# Altium project PICO_Probe_v_2_1.PrjPcb
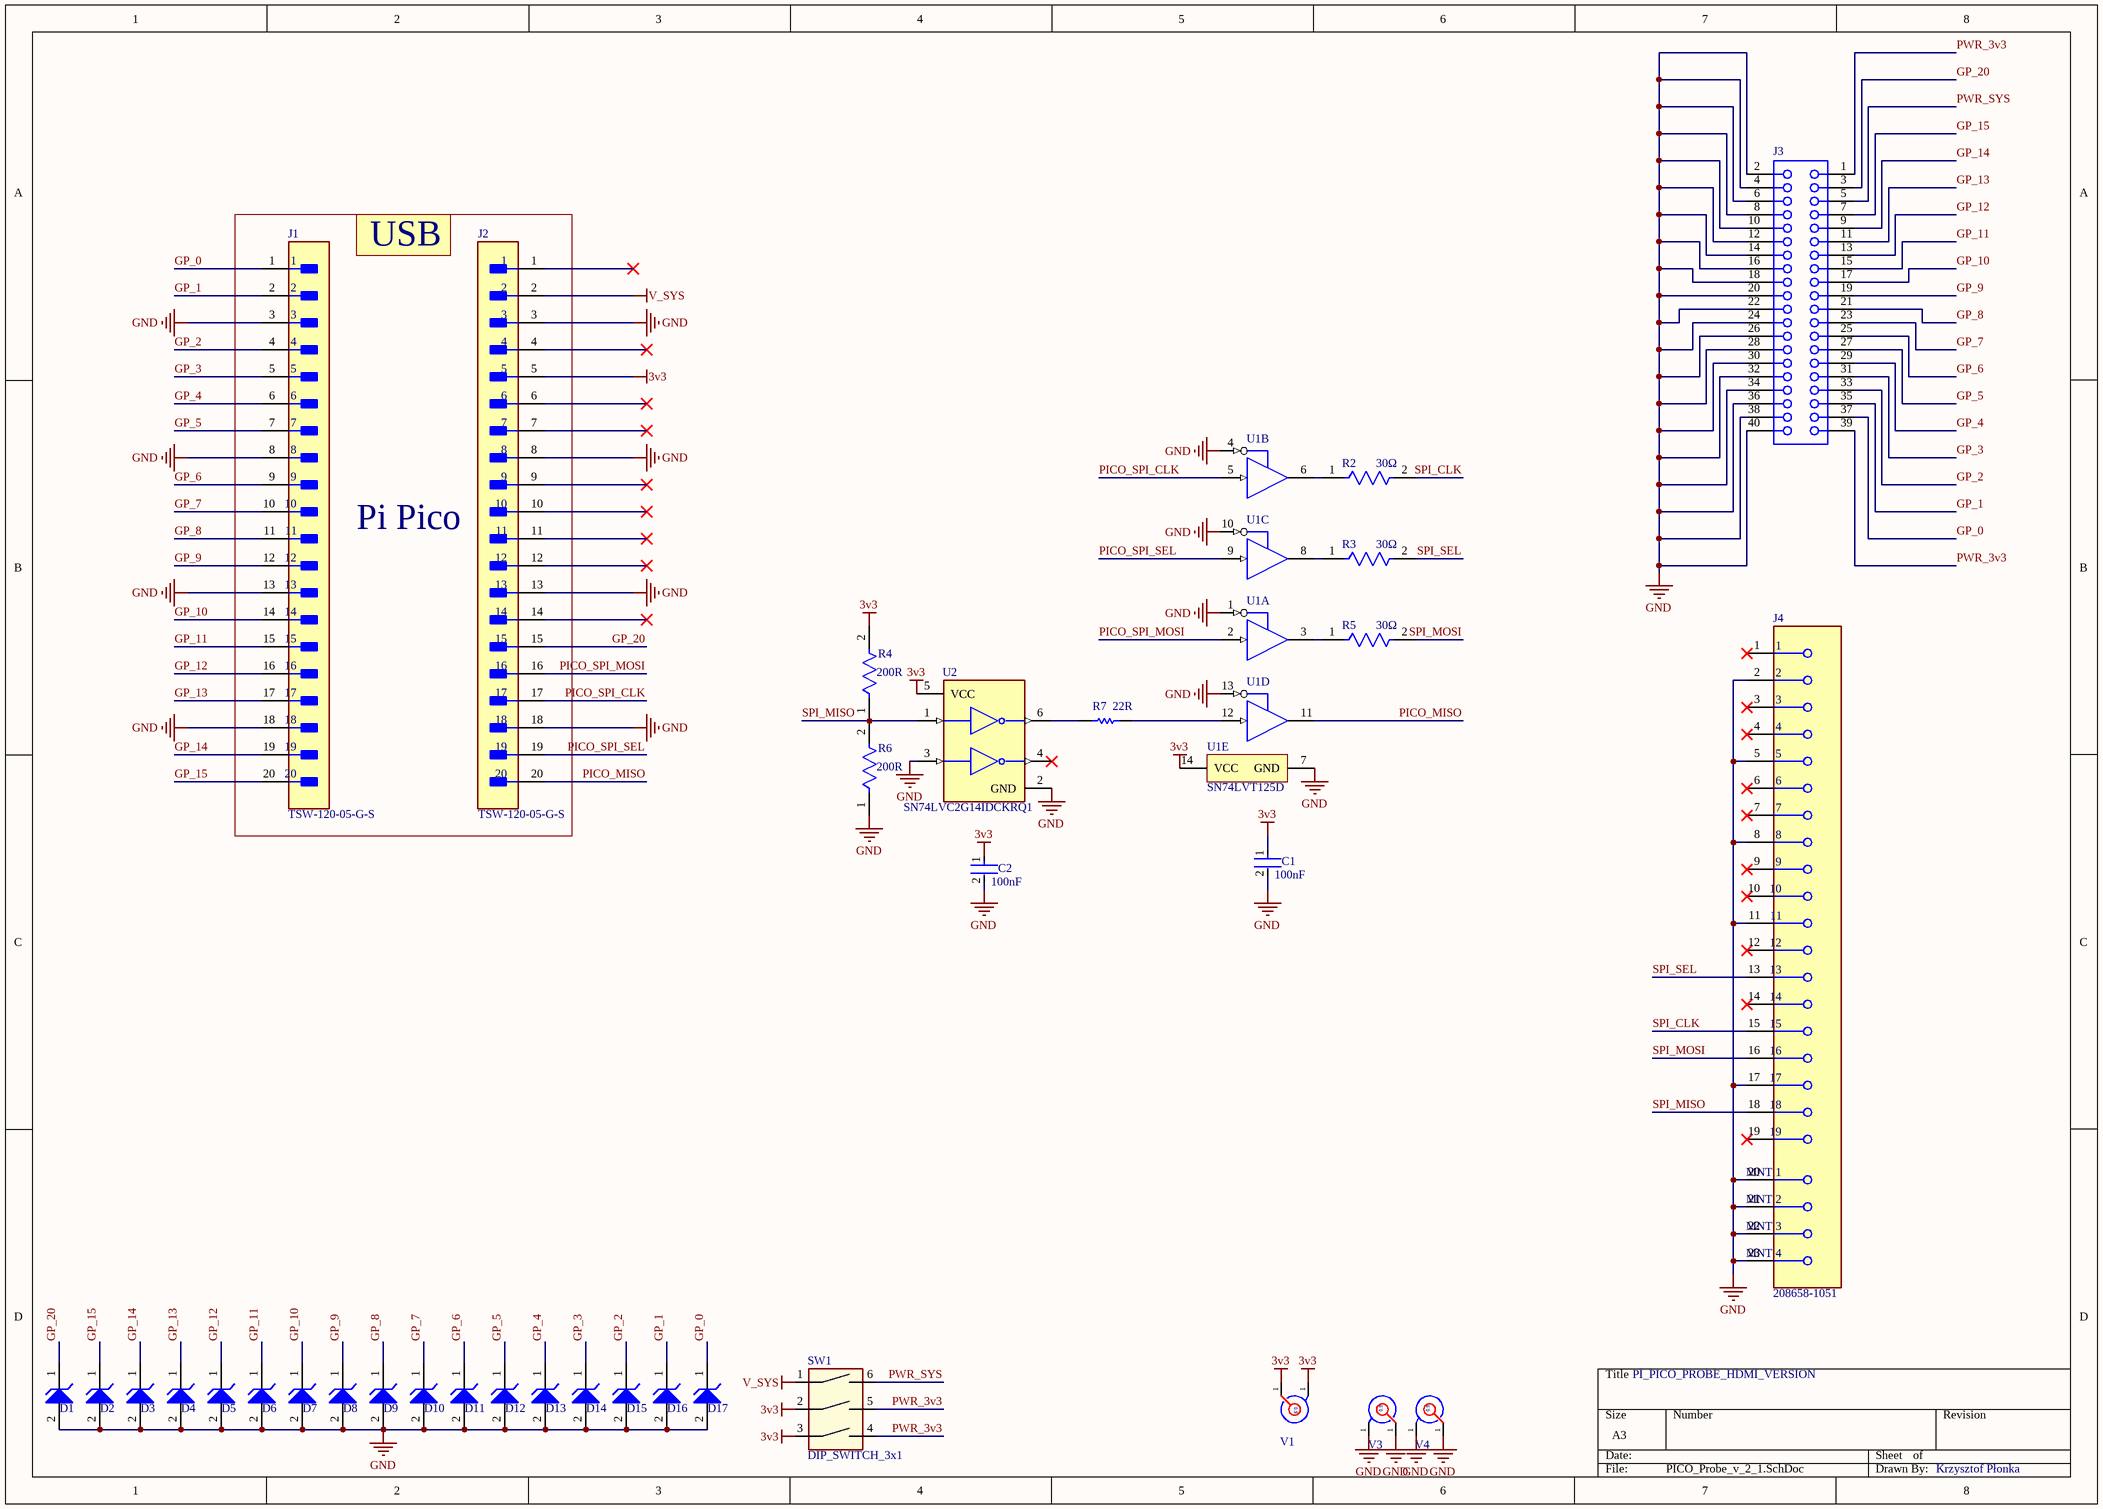
[diagram p0: PICO_Probe_v_2_1.SchDoc]
1 sheet, 35 parts. Net scope: global (net labels, ports and power ports of the same name join across sheets).
Board file: PICO_Probe_v_2_1.PcbDoc

## Sheet PICO_Probe_v_2_1.SchDoc
size A3; SheetNumber: 1; SheetTotal: 1

### Parts
C1  value 100nF  [FP-GRM033-0_03-IPC_A]  (hidden comment: GRM033Z71C104KE14J)
C2  value 100nF  [FP-GRM033-0_03-IPC_A]  (hidden comment: GRM033Z71C104KE14J)
D1  MM5Z3V6T1G  [ONSC-SOD-523-2-502-01_V]  (value not drawn)
D2  MM5Z3V6T1G  [ONSC-SOD-523-2-502-01_V]  (value not drawn)
D3  MM5Z3V6T1G  [ONSC-SOD-523-2-502-01_V]  (value not drawn)
D4  MM5Z3V6T1G  [ONSC-SOD-523-2-502-01_V]  (value not drawn)
D5  MM5Z3V6T1G  [ONSC-SOD-523-2-502-01_V]  (value not drawn)
D6  MM5Z3V6T1G  [ONSC-SOD-523-2-502-01_V]  (value not drawn)
D7  MM5Z3V6T1G  [ONSC-SOD-523-2-502-01_V]  (value not drawn)
D8  MM5Z3V6T1G  [ONSC-SOD-523-2-502-01_V]  (value not drawn)
D9  MM5Z3V6T1G  [ONSC-SOD-523-2-502-01_V]  (value not drawn)
D10  MM5Z3V6T1G  [ONSC-SOD-523-2-502-01_V]  (value not drawn)
D11  MM5Z3V6T1G  [ONSC-SOD-523-2-502-01_V]  (value not drawn)
D12  MM5Z3V6T1G  [ONSC-SOD-523-2-502-01_V]  (value not drawn)
D13  MM5Z3V6T1G  [ONSC-SOD-523-2-502-01_V]  (value not drawn)
D14  MM5Z3V6T1G  [ONSC-SOD-523-2-502-01_V]  (value not drawn)
D15  MM5Z3V6T1G  [ONSC-SOD-523-2-502-01_V]  (value not drawn)
D16  MM5Z3V6T1G  [ONSC-SOD-523-2-502-01_V]  (value not drawn)
D17  MM5Z3V6T1G  [ONSC-SOD-523-2-502-01_V]  (value not drawn)
J1  TSW-120-05-G-S  [FP-TSW-120-05-G-S-MFG]
J2  TSW-120-05-G-S  [FP-TSW-120-05-G-S-MFG]
J3  SSW-120-02-G-D-RA  [SMTC-SSW-120-02-X-D-RA]  (value not drawn)
J4  208658-1051  [FP-208658-1051-MFG]
R2  Resistance: 30Ω  [FP-ERJ2RK-MFG]  (hidden comment: ERJ-2RKF30R0X)
R3  Resistance: 30Ω  [FP-ERJ2RK-MFG]  (hidden comment: ERJ-2RKF30R0X)
R4  Resistance: 200R  [FP-CRCW0402-e3-IPC_C]  (hidden comment: CRCW0402200RFKED)
R5  Resistance: 30Ω  [FP-ERJ2RK-MFG]  (hidden comment: ERJ-2RKF30R0X)
R6  Resistance: 200R  [FP-CRCW0402-e3-IPC_C]  (hidden comment: CRCW0402200RFKED)
R7  value 22R  [RESC1005X40X25ML10T10]  (hidden comment: CR0402-FX-22R0GLF)
SW1  DIP_SWITCH_3x1  [DIP_SWITCH_3x1]
U1  SN74LVT125D  [D0014A_M]  (value not drawn)  (parts A,B,C,D,E of 5)
U2  SN74LVC2G14IDCKRQ1  [FP-DCK0006A-MFG]
V1  Copper_Via_09  [Copper_Via_09]  (value not drawn)
V3  Copper_Via_09  [Copper_Via_09]  (value not drawn)
V4  Copper_Via_09  [Copper_Via_09]  (value not drawn)

### Nets
3v3: C1.1 C2.1 J2.5 R4.2 SW1.2 SW1.3 U1.14(VCC) U2.5(VCC) V1.1
GND: C1.2 C2.2 D1.2(A) D2.2(A) D3.2(A) D4.2(A) D5.2(A) D6.2(A) D7.2(A) D8.2(A) D9.2(A) D10.2(A) D11.2(A) D12.2(A) D13.2(A) D14.2(A) D15.2(A) D16.2(A) D17.2(A) J1.3 J1.8 J1.13 J1.18 J2.3 J2.8 J2.13 J2.18 J3.2 J3.4 J3.6 J3.8 J3.10 J3.12 J3.14 J3.16 J3.18 J3.20 J3.22 J3.24 J3.26 J3.28 J3.30 J3.32 J3.34 J3.36 J3.38 J3.40 J4.2 J4.5 J4.8 J4.11 J4.17 J4.20(MNT_1) J4.21(MNT_2) J4.22(MNT_3) J4.23(MNT_4) R6.1 U1.1(1~{OE}) U1.4(2~{OE}) U1.7(GND) U1.10(3~{OE}) U1.13(4~{OE}) U2.2(GND) U2.3(2A) V3.1 V4.1
V_SYS: J2.2 SW1.1
GP_0: D17.1(K) J1.1 J3.37
GP_1: D16.1(K) J1.2 J3.35
GP_2: D15.1(K) J1.4 J3.33
GP_3: D14.1(K) J1.5 J3.31
GP_4: D13.1(K) J1.6 J3.29
GP_5: D12.1(K) J1.7 J3.27
GP_6: D11.1(K) J1.9 J3.25
GP_7: D10.1(K) J1.10 J3.23
GP_8: D9.1(K) J1.11 J3.21
GP_9: D8.1(K) J1.12 J3.19
GP_10: D7.1(K) J1.14 J3.17
GP_11: D6.1(K) J1.15 J3.15
GP_12: D5.1(K) J1.16 J3.13
GP_13: D4.1(K) J1.17 J3.11
GP_14: D3.1(K) J1.19 J3.9
GP_15: D2.1(K) J1.20 J3.7
GP_20: D1.1(K) J2.15 J3.3
PICO_MISO: J2.20 U1.11(4Y)
PICO_SPI_CLK: J2.17 U1.5(2A)
PICO_SPI_MOSI: J2.16 U1.2(1A)
PICO_SPI_SEL: J2.19 U1.9(3A)
PWR_3v3: J3.1 J3.39 SW1.4 SW1.5
PWR_SYS: J3.5 SW1.6
SPI_CLK: J4.15 R2.2
SPI_MISO: J4.18 R4.1 R6.2 U2.1(1A)
SPI_MOSI: J4.16 R5.2
SPI_SEL: J4.13 R3.2
NetR2_1: R2.1 U1.6(2Y)
NetR3_1: R3.1 U1.8(3Y)
NetR5_1: R5.1 U1.3(1Y)
NetR7_1: R7.1 U2.6(1Y)
NetR7_2: R7.2 U1.12(4A)

Not connected (* = marked no-connect by the designer): J2 1* 4* 6* 7* 9* 10* 11* 12* 14*; J4 1* 3* 4* 6* 7* 9* 10* 12* 14* 19*; U2 4(2Y)*

### Notes on the sheet
- USB
- (near J2) Pi Pico
- PI_PICO_PROBE_HDMI_VERSION
- Krzysztof Płonka
- (in symbol Copper_Via_09) 0.9

### Library data of the parts
C1 C2 = CMP-06035-043202-1: Chip Multilayer Ceramic Capacitors for General Purpose, 0201, 0.10uF, X7R, 15%, 10%, 16V
D1-D17 = CMP-1060-00749-1: Zener Voltage Regulator, 500 mW, 2-Pin SOD-523, Pb-Free, Tape and Reel; Manufacturer: On Semiconductor; P Max (W): 0.5; VZ Typ (V): 3.6; PackageVersion: Rev. E, 09/2010; Packing: Tape and Reel; DatasheetVersion: Rev. 10; ComponentLink2URL: http://www.onsemi.cn/pub_link/Collateral/MM5Z2V4T1-D.PDF; ComponentLink3Description: Package Specification; ComponentLink1URL: http://www.onsemi.com/; RoHS: Pb-Free; PartNumber: MM5Z3V6T1G; PackageDescription: 2-Pin SOD, Body 1.2 x 0.8 mm; ComponentLink1Description: Manufacturer URL; ComponentLink3URL: http://www.onsemi.com/pub_link/Collateral/502-01.PDF; Mounting Technology: Surface Mount; PackageReference: SOD-523-2-502-01; ComponentLink2Description: Datasheet
J1 J2 = CMP-00575-00271415-1: TSW-120-05-G-S Headers & Wire Housings Classic PCB Header Strips, 0.100 pitch; NexarPartId: 271415; Manufacturer Lifecycle Status: PRODUCTION; Number of Contacts: 20; Gender: Male; Pitch: 2.54mm; Connector Type: Male Pin; Lead Free: Lead Free; Housing Material: Plastic; RoHS: Compliant; Housing Color: Black; Width: 2.54mm; Height: 2.54mm; Contact Plating: Gold; Lead Pitch: 2.54mm; Color: Black; Number of Positions: 20; Lifecycle Status: Production; Contact Material: Bronze; Contact Mating Length: 2.667mm; Length: 50.8mm; REACH SVHC: No SVHC; Termination: Solder; Mount: Through Hole; Number of Rows: 1
J3 = CMP-1023-00460-1: SQ Post Socket, Through-hole, Right Angle, -55 to 125 degC, 2.54 mm Pitch, 40-Pin, Female, RoHS; Manufacturer: Samtec; Pitch: 2.54 mm; ComponentLink2Description: Datasheet; ComponentLink3Description: Package Specification; PackageVersion: CA, 6/1987; ComponentLink1URL: http://www.samtec.com; ComponentLink3URL: http://www.samtec.com/documents/webfiles/cpdf/SSW-1XX-XX-XXX-X-XX-XXX-XX-MKT.pdf; Orientation: Right Angle; PackageReference: SSW-120-02-X-D-RA; ComponentLink2URL: http://www.samtec.com/documents/webfiles/pdf/SSW_TH.PDF; PackageDescription: Assembly, Socket Strip .016 X .031 Tail; Temperature Range: -55 to 125 degC; DatasheetVersion: F-214; RoHS: True; ComponentLink1Description: Manufacturer URL; Mounting Technology: Through-hole; PartNumber: SSW-120-02-G-D-RA
J4 = CMP-04768-000005-1: CONN RCPT HDMI V2.1 19POS SMD RA
R2 R3 R5 = CMP-2002-00857-2: NexarPartId: 42824405; Power Rating: 100mW; Voltage Rating: 50V; Temperature Coefficient: 100ppm/°C; Tolerance: 1%; Width: 508µm; Contact Plating: Tin; REACH SVHC: Yes; Case Code (Imperial): 0402; Composition: Thick Film; Number of Terminations: 2; Lead Free: Lead Free; Schedule B: 8533210045, 8533210045; Length: 1mm; Features: Automotive AEC-Q200; Military Standard: Not; Termination: SMD/SMT; Min Operating Temperature: -55°C; Mount: Surface Mount; RoHS: Compliant; Max Operating Temperature: 155°C; Height: 350µm; Case/Package: 0402; Max Power Dissipation: 100mW; Depth: 500µm; Case Code (Metric): 1005; Voltage Rating (DC): 50V; Lifecycle Status: Production; Packaging: Cut Tape
R4 R6 = CMP-1011-00429-3: RES Thick Film, 200Ω, 1%, 0.063W, 100ppm/°C, 0402; Max Power Dissipation: 63mW; Voltage Rating: 50V; Termination: SMD/SMT; Weight: 2.3E-05oz; Case/Package: 0402; Contact Plating: Tin; Number of Pins: 2; Width: 0.5mm; Height: 0.35mm; Case Code (Metric): 1005; Military Standard: Not; Features: Automotive AEC-Q200; Power Rating: 63mW; Temperature Coefficient: 100ppm/°C; Tolerance: 1%; Lead Free: Lead Free; Depth: 0.5mm; Max Operating Temperature: 155°C; Min Operating Temperature: -55°C; Package Quantity: 10; Voltage Rating (DC): 50V; Composition: Thick Film; Mount: Surface Mount; Radiation Hardening: No; Length: 1mm; Packaging: Tape and Reel; Number of Terminations: 2; Case Code (Imperial): 0402
R7 = CMP-2002-04945-1: Manufacturer: Bourns; Part Number: CR0402-FX-22R0GLF
U1 = CMP-0440-00024-3: 3.3-V ABT Quadruple Bus Buffers With 3-State Outputs, D0014A, TUBE; Manufacturer: Texas Instruments; Input Type: TTL/CMOS; VCC(Min)(V): 2.7; tpd @ Nom Voltage(Max)(ns): 4; Output Type: LVTTL; F @ Nom Voltage(Max)(Mhz): 100; Voltage(Nom)(V): 3.3; Rating: Catalog; ICC @ Nom Voltage(Max)(mA): 0.007; VCC(Max)(V): 3.6; Generic Part Number: SN74LVT125; Bits(#): 4; Code_JEDEC: MS-012; DatasheetVersion: SCBS133F; Operating Temperature Range(C): -40 to 85; PackageReference: D0014A; PackageVersion: http://www.ti.com/lit/ml/mpds177g/mpds177g.pdf
U2 = CMP-0859-00447-5: IC INVERT SCHMITT 2CH 2IN SC70-6; Propagation Delay: 9.5ns; Number of Inputs: 1; Min Supply Voltage: 1.65V; Turn-On Delay Time: 4.3ns; Max Supply Voltage: 5.5V; Schmitt Trigger Input: Yes; Quiescent Current: 10uA; Number of Elements: 2; Max Output Current: 32mA; Input Type: SCHMITT TRIGGER; High Level Output Current: -32mA; Logic Function: Buffer; Width: 1.25mm; Lead Free: Lead Free; Package Quantity: 3000; Min Operating Temperature: -40°C; Termination: SMD/SMT; Mount: Surface Mount; Radiation Hardening: No; Number of Pins: 6; Height: 0.9mm; Output Current: 32mA; REACH SVHC: No SVHC; RoHS Compliant: Yes; Contact Plating: Gold; Max Operating Temperature: 85°C; Length: 2mm; Number of Bits: 2; Number of Circuits: 2; Technology: CMOS; Number of Gates: 2; Low Level Output Current: 32mA; Case/Package: SC; Packaging: Tape and Reel; Series: 74LVC
V1 V3 V4 = Copper_Via_09: Copper Via 0.9mm hole